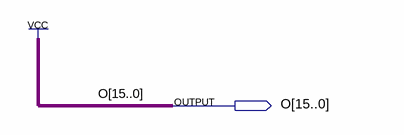
[diagram p0: schematic sheet]
// Quartus schematic z_ffff.bdf as structural Verilog: 0 symbols, 1 pins
module z_ffff (
  output [15:0] O
);


  assign O = {16{1'b1}};
endmodule
